# EAGLE design adapter1 (EAGLE 7.2.0)
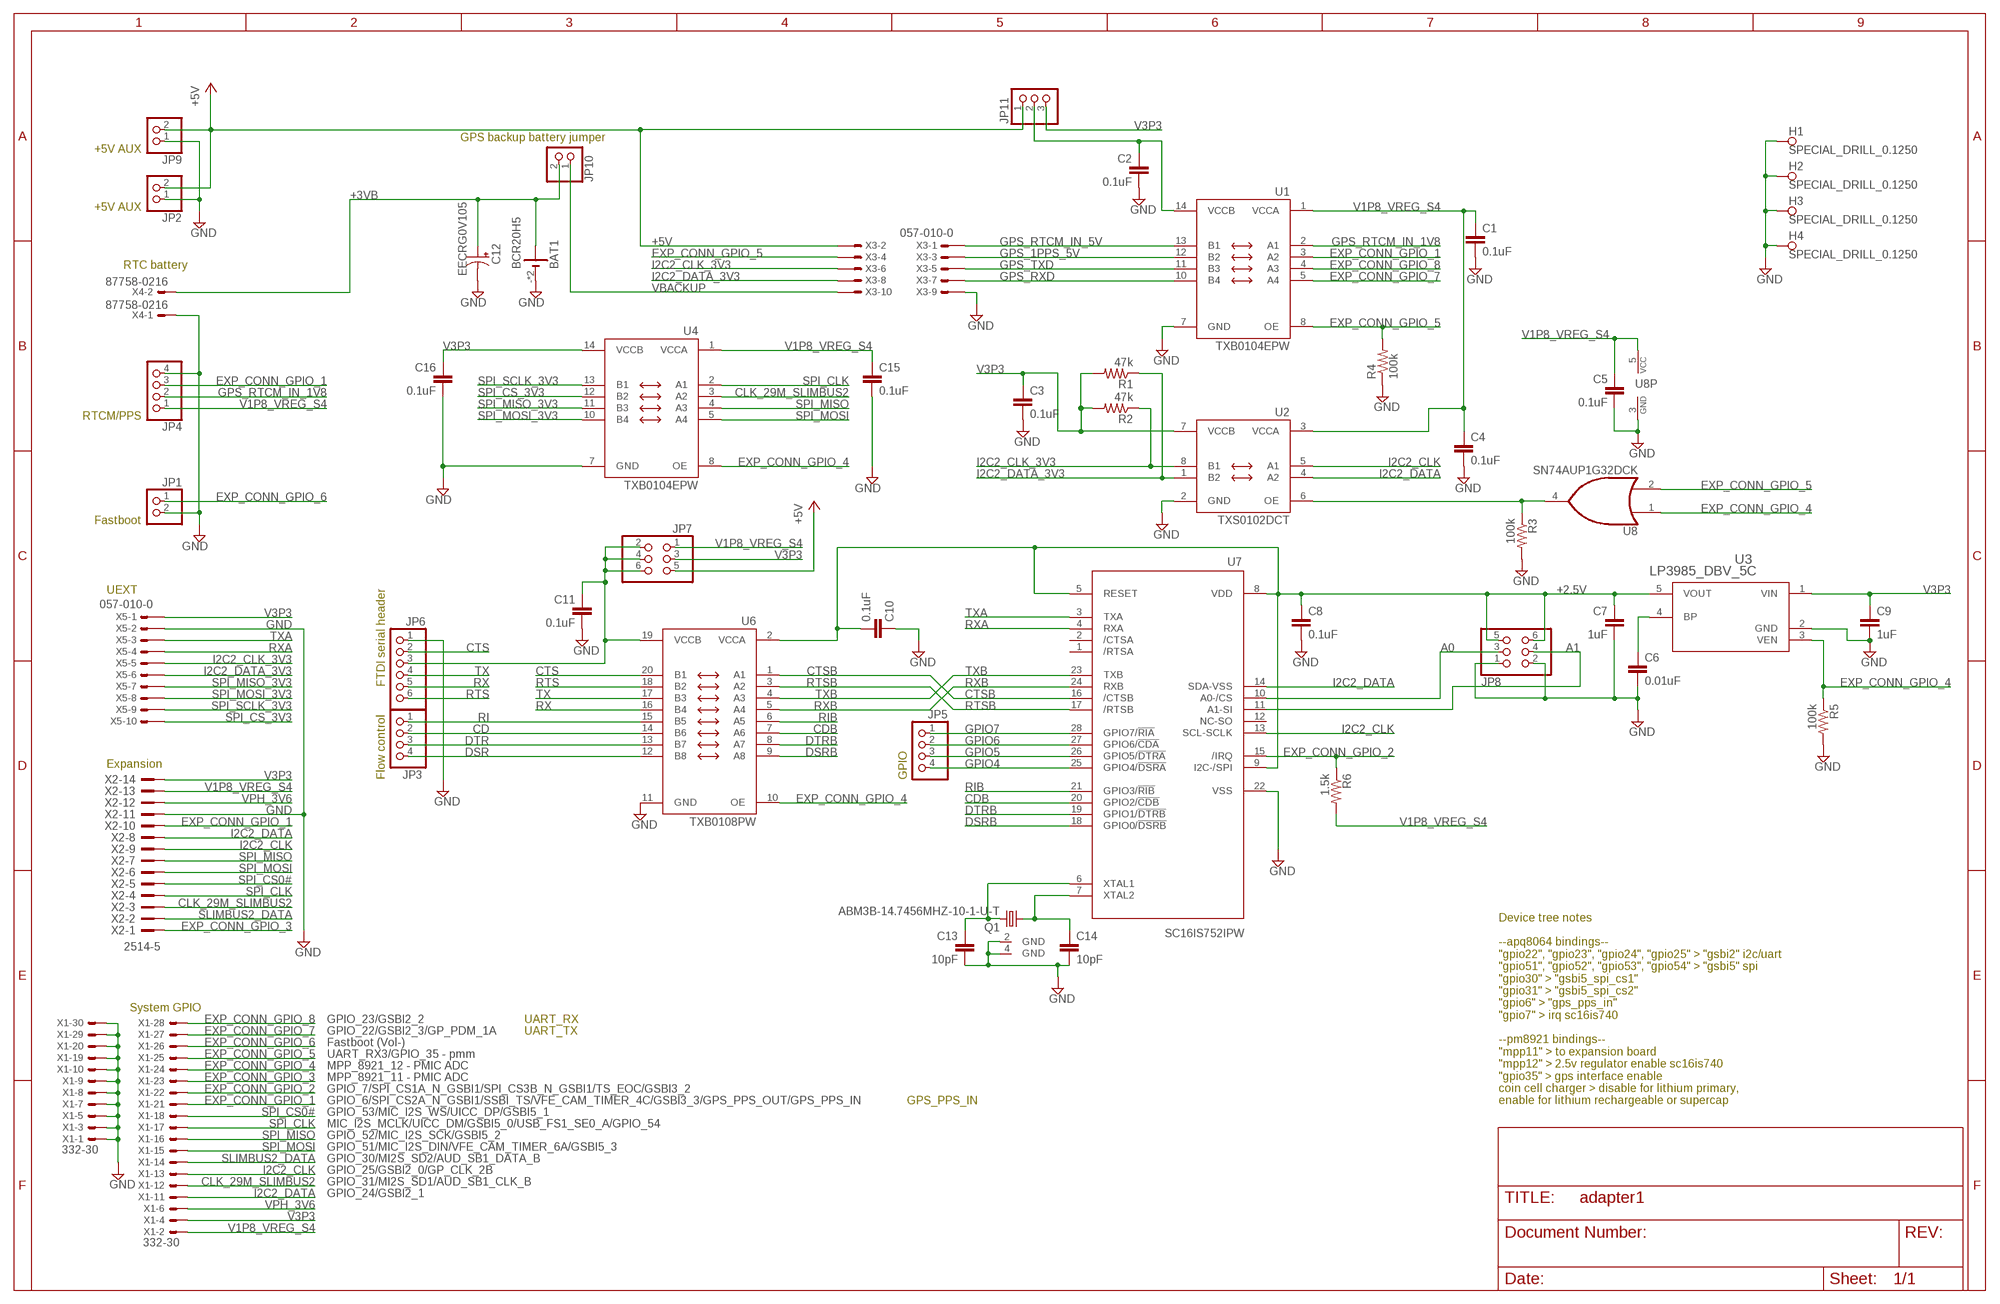
[diagram p0: schematic, sheet 1]

## Parts
BAT1  BCR20H5  BCR20H5_1066  [BCR20H5_1066]
C1  0.1uF  C-EUC0603  [C0603]
C2  0.1uF  C-EUC0603  [C0603]
C3  0.1uF  C-EUC0603  [C0603]
C4  0.1uF  C-EUC0603  [C0603]
C5  0.1uF  C-EUC0603  [C0603]
C6  0.01uF  C-EUC0603  [C0603]
C7  1uF  C-EUC0603  [C0603]
C8  0.1uF  C-EUC0603  [C0603]
C9  1uF  C-EUC0603  [C0603]
C10  0.1uF  C-EUC0603  [C0603]
C11  0.1uF  C-EUC0603  [C0603]
C12  EECRG0V105  CPOL-USE10-20  [EB20D]
C13  10pF  C-EUC0603  [C0603]
C14  10pF  C-EUC0603  [C0603]
C15  0.1uF  C-EUC0603  [C0603]
C16  0.1uF  C-EUC0603  [C0603]
H1  SPECIAL_DRILL_0.1250  [PAD_0.1250]
H2  SPECIAL_DRILL_0.1250  [PAD_0.1250]
H3  SPECIAL_DRILL_0.1250  [PAD_0.1250]
H4  SPECIAL_DRILL_0.1250  [PAD_0.1250]
JP1  PINHD-1X2/90  [1X02/90]
JP2  PINHD-1X2/90  [1X02/90]
JP3  PINHD-1X4/90  [1X04/90]
JP4  PINHD-1X4/90  [1X04/90]
JP5  PINHD-1X4/90  [1X04/90]
JP6  PINHD-1X6/90  [1X06/90]
JP7  PINHD-2X3/90  [2X03/90]
JP8  PINHD-2X3  [2X03]
JP9  PINHD-1X2/90  [1X02/90]
JP10  PINHD-1X2  [1X02]
JP11  PINHD-1X3  [1X03]
Q1  ABM3B-14.7456MHZ-10-1-U-T  C-SHIELDABM3B  [ABM3B]
R1  47k  R-US_R0603  [R0603]
R2  47k  R-US_R0603  [R0603]
R3  100k  R-US_R0603  [R0603]
R4  100k  R-US_R0603  [R0603]
R5  100k  R-US_R0603  [R0603]
R6  1.5k  R-US_R0603  [R0603]
U1  TXB0104EPW  TXS0104EPW  [PW_R-PDSO-G14]
U2  TXS0102DCT  [DCT_R-PDSO-G8]
U3  LP3985_DBV_5C  [MF05A-M]
U4  TXB0104EPW  TXS0104EPW  [PW_R-PDSO-G14]
U6  TXB0108PW  TXS0108PW  [PW_R-PDSO-G20]
U7  SC16IS752IPW  [SSOP28]
U8  SN74AUP1G32DCK  74AHC1G32DCK  [SC70-5]
X1  332-30  [332-30]
X2  2514-5  [PAK100/2500-5-14]
X3  057-010-0  [057-010-0]
X4  87758-0216  [87758-0216]
X5  057-010-0  [057-010-0]

## Nets
+2.5V: C7.1 C8.1 C10.2 JP8.5 JP8.6 U3.5(VOUT) U6.2(VCCA) U7.5(RESET) U7.8(VDD) U7.9(I2C-/SPI)
+3VB: BAT1.+ BAT1.+1(+) C12.+ JP10.2 X4.2
+5V: JP2.2 JP7.5 JP9.2 JP11.1 X3.2
A0: JP8.3 U7.10(A0-/CS)
A1: JP8.4 U7.11(A1-SI)
CD: JP3.2 U6.14(B6)
CDB: U6.7(A6) U7.20(GPIO2/!CDB)
CLK_29M_SLIMBUS2: U4.3(A2) X1.12 X2.3
CTS: JP6.2 U6.20(B1)
CTSB: U6.1(A1) U7.16(/CTSB)
DSR: JP3.4 U6.12(B8)
DSRB: U6.9(A8) U7.18(GPIO0/!DSRB)
DTR: JP3.3 U6.13(B7)
DTRB: U6.8(A7) U7.19(GPIO1/!DTRB)
EXP_CONN_GPIO_1: JP4.3 U1.3(A2) X1.21 X2.10
EXP_CONN_GPIO_2: R6.1 U7.15(/IRQ) X1.22
EXP_CONN_GPIO_3: X1.23 X2.1
EXP_CONN_GPIO_4: R5.1 U3.3(VEN) U4.8(OE) U6.10(OE) U8.1(I0) X1.24
EXP_CONN_GPIO_5: R4.2 U1.8(OE) U8.2(I1) X1.25 X3.4
EXP_CONN_GPIO_6: JP1.1 X1.26
EXP_CONN_GPIO_7: U1.5(A4) X1.27
EXP_CONN_GPIO_8: U1.4(A3) X1.28
GND: BAT1.- BAT1.-1(-) C1.2 C2.2 C3.2 C4.2 C5.2 C6.2 C7.2 C8.2 C9.2 C10.1 C11.2 C12.- C13.2 C14.2 C15.2 C16.2 H1.1 H2.1 H3.1 H4.1 JP1.2 JP2.1 JP4.4 JP6.1 JP8.1 JP8.2 JP9.1 Q1.2(GND) Q1.4(GND) R3.2 R4.1 R5.2 U1.7(GND) U2.2(GND) U3.2(GND) U4.7(GND) U6.11(GND) U7.22(VSS) U8.3(GND) X1.1 X1.3 X1.5 X1.7 X1.8 X1.9 X1.10 X1.19 X1.20 X1.29 X1.30 X2.11 X3.9 X4.1 X5.2
GPIO4: JP5.4 U7.25(GPIO4/!DSRA)
GPIO5: JP5.3 U7.26(GPIO5/!DTRA)
GPIO6: JP5.2 U7.27(GPIO6/!CDA)
GPIO7: JP5.1 U7.28(GPIO7/!RIA)
GPS_1PPS_5V: U1.12(B2) X3.3
GPS_RTCM_IN_1V8: JP4.2 U1.2(A1)
GPS_RTCM_IN_5V: U1.13(B1) X3.1
GPS_RXD: U1.10(B4) X3.7
GPS_TXD: U1.11(B3) X3.5
I2C2_CLK: U2.5(A1) U7.13(SCL-SCLK) X1.13 X2.9
I2C2_CLK_3V3: R2.1 U2.8(B1) X3.6 X5.5
I2C2_DATA: U2.4(A2) U7.14(SDA-VSS) X1.11 X2.8
I2C2_DATA_3V3: R1.1 U2.1(B2) X3.8 X5.6
N$2: C2.1 JP11.2 U1.14(VCCB)
N$3: C14.1 Q1.3 U7.7(XTAL2)
N$4: C13.1 Q1.1 U7.6(XTAL1)
N$5: C11.1 JP6.3 JP7.2 JP7.4 JP7.6 U6.19(VCCB)
N$6: C6.1 U3.4(BP)
N$13: R3.1 U2.6(OE) U8.4(O)
RI: JP3.1 U6.15(B5)
RIB: U6.6(A5) U7.21(GPIO3/!RIB)
RTS: JP6.6 U6.18(B2)
RTSB: U6.3(A2) U7.17(/RTSB)
RX: JP6.5 U6.16(B4)
RXA: U7.4(RXA) X5.4
RXB: U6.5(A4) U7.24(RXB)
SLIMBUS2_DATA: X1.14 X2.2
SPI_CLK: U4.2(A1) X1.17 X2.4
SPI_CS0#: X1.18 X2.5
SPI_CS_3V3: U4.12(B2) X5.10
SPI_MISO: U4.4(A3) X1.16 X2.7
SPI_MISO_3V3: U4.11(B3) X5.7
SPI_MOSI: U4.5(A4) X1.15 X2.6
SPI_MOSI_3V3: U4.10(B4) X5.8
SPI_SCLK_3V3: U4.13(B1) X5.9
TX: JP6.4 U6.17(B3)
TXA: U7.3(TXA) X5.3
TXB: U6.4(A3) U7.23(TXB)
V1P8_VREG_S4: C1.1 C4.1 C5.1 C15.1 JP4.1 JP7.1 R6.2 U1.1(VCCA) U2.3(VCCA) U4.1(VCCA) U8.5(VCC) X1.2 X2.13
V3P3: C3.1 C9.1 C16.1 JP7.3 JP11.3 R1.2 R2.2 U2.7(VCCB) U3.1(VIN) U4.14(VCCB) X1.4 X2.14 X5.1
VBACKUP: JP10.1 X3.10
VPH_3V6: X1.6 X2.12
Unconnected: U7.1(/RTSA) U7.2(/CTSA) U7.12(NC-SO)

## Notes on the sheet
- GPS backup battery jumper
- +5V AUX
- +5V AUX
- RTC battery
- RTCM/PPS
- Fastboot
- UEXT
- FTDI serial header
- Expansion
- Flow control | GPIO
- System GPIO
- GPIO_23/GSBI2_2 | UART_RX
- GPIO_22/GSBI2_3/GP_PDM_1A | UART_TX
- Fastboot (Vol-)
- UART_RX3/GPIO_35 - pmm
- MPP_8921_12 - PMIC ADC
- MPP_8921_11 - PMIC ADC
- GPIO_7/SPI_CS1A_N_GSBI1/SPI_CS3B_N_GSBI1/TS_EOC/GSBI3_2
- GPIO_6/SPI_CS2A_N_GSBI1/SSBI_TS/VFE_CAM_TIMER_4C/GSBI3_3/GPS_PPS_OUT/GPS_PPS_IN | GPS_PPS_IN
- Device tree notes
  
  --apq8064 bindings--
  "gpio22", "gpio23", "gpio24", "gpio25" > "gsbi2" i2c/uart
  "gpio51", "gpio52", "gpio53", "gpio54" > "gsbi5" spi
  "gpio30" > "gsbi5_spi_cs1"
  "gpio31" > "gsbi5_spi_cs2"
  "gpio6" > "gps_pps_in"
  "gpio7" > irq sc16is740
  
  --pm8921 bindings--
  "mpp11" > to expansion board
  "mpp12" > 2.5v regulator enable sc16is740
  "gpio35" > gps interface enable
  coin cell charger > disable for lithium primary,
  enable for lithium rechargeable or supercap
- GPIO_53/MIC_I2S_WS/UICC_DP/GSBI5_1
- MIC_I2S_MCLK/UICC_DM/GSBI5_0/USB_FS1_SE0_A/GPIO_54
- GPIO_52/MIC_I2S_SCK/GSBI5_2
- GPIO_51/MIC_I2S_DIN/VFE_CAM_TIMER_6A/GSBI5_3
- GPIO_30/MI2S_SD2/AUD_SB1_DATA_B
- GPIO_25/GSBI2_0/GP_CLK_2B
- GPIO_31/MI2S_SD1/AUD_SB1_CLK_B
- GPIO_24/GSBI2_1

## Library data of the parts
BAT1 = battery holders:BCR20H5_1066
C1-C11 C13-C16 = rcl:C-EU: CAPACITOR, European symbol
C12 = rcl:CPOL-US: POLARIZED CAPACITOR, American symbol
H1-H4 = special-drill:SPECIAL_DRILL_: Special drills
JP1 JP2 JP9 JP10 = pinhead:PINHD-1X2: PIN HEADER
JP3-JP5 = pinhead:PINHD-1X4: PIN HEADER
JP6 = pinhead:PINHD-1X6: PIN HEADER
JP7 JP8 = pinhead:PINHD-2X3: PIN HEADER
JP11 = pinhead:PINHD-1X3: PIN HEADER
Q1 = crystal:C-SHIELD
R1-R6 = rcl:R-US_: RESISTOR, American symbol
U1 U4 = texas-1:TXS0104
U2 = texas-1:TXS0102
U3 = LP3985:LP3985_DBV_5
U6 = texas-1:TXS0108
U7 = sc16is740:SC16IS752
U8 = 74xx-little-us:74*1G32: 2-input OR gate
X1 = con-garry:332-30: 30 Pin - 2mm Dual Row Source: www.mpe-connector.de / garry_shortform_2012.pdf
X2 = con-3m:2514-: 3M (TM) Pak 100 4-Wall Header Source: 3M; MPN: N2514-5002RB; OC_FARNELL: 1788673; OC_NEWARK: 97K6709
X3 X5 = con-panduit:057-010-: CONNECTOR 10-pin series 057 contact pc board low profile headers; OC_FARNELL: unknown; OC_NEWARK: unknown
X4 = con-molex:87758-0216: 2 Pin - 2mm Dual Row Single Wafer, Vertical T/H HDR Source: http://www.molex.com/pdm_docs/sd/877580616_sd.pdf; MPN: 87758-0216; OC_FARNELL: unknown; OC_NEWARK: 94M1513

## Board
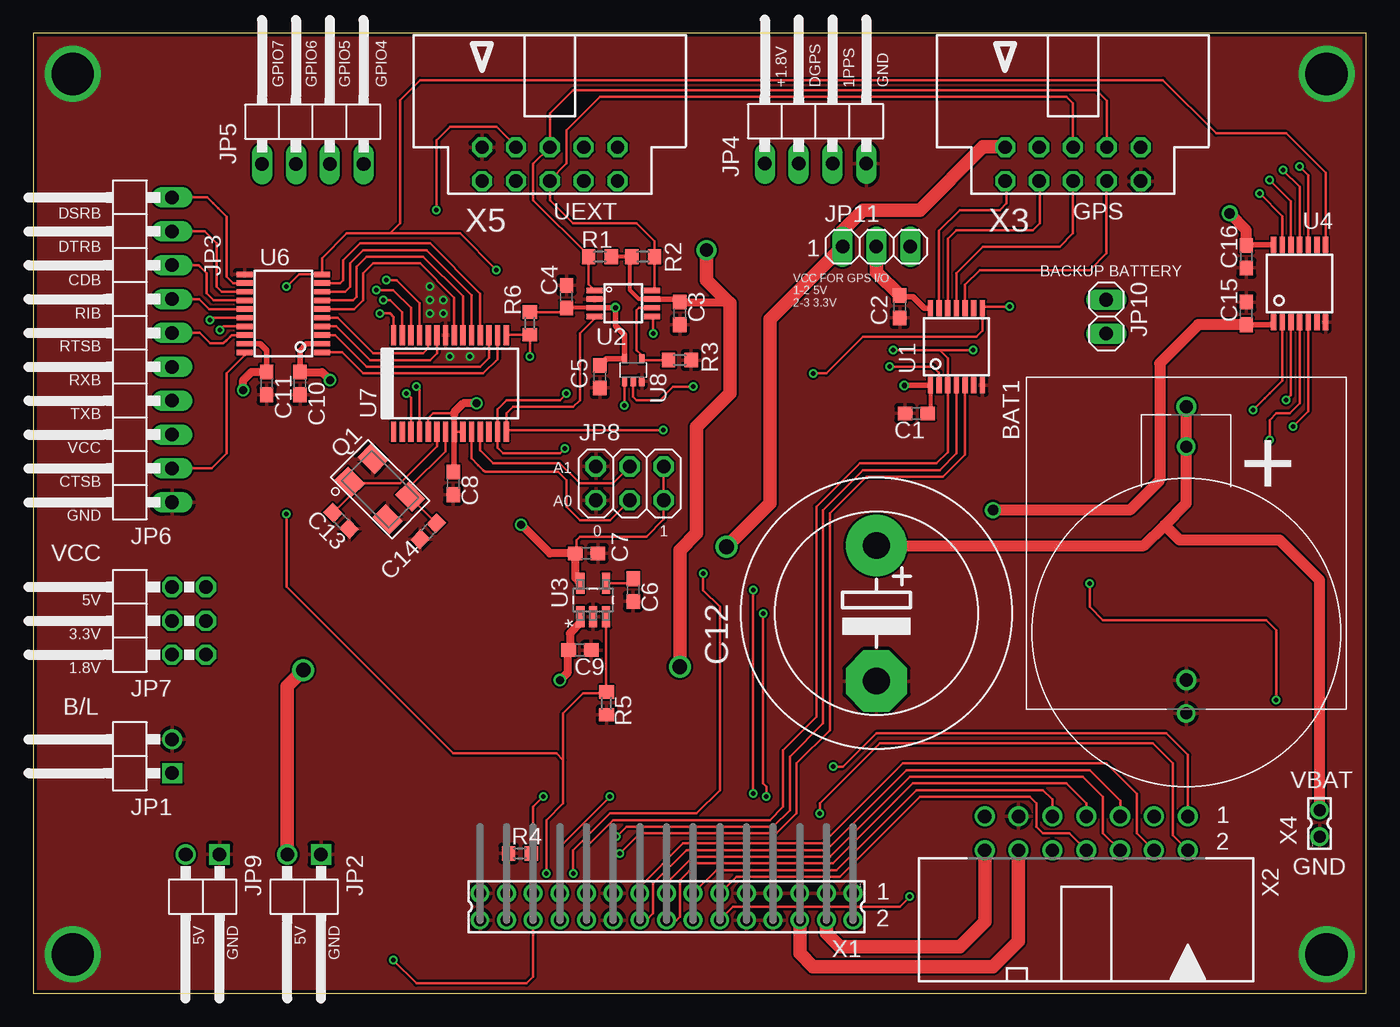
[diagram p1: board, top side]
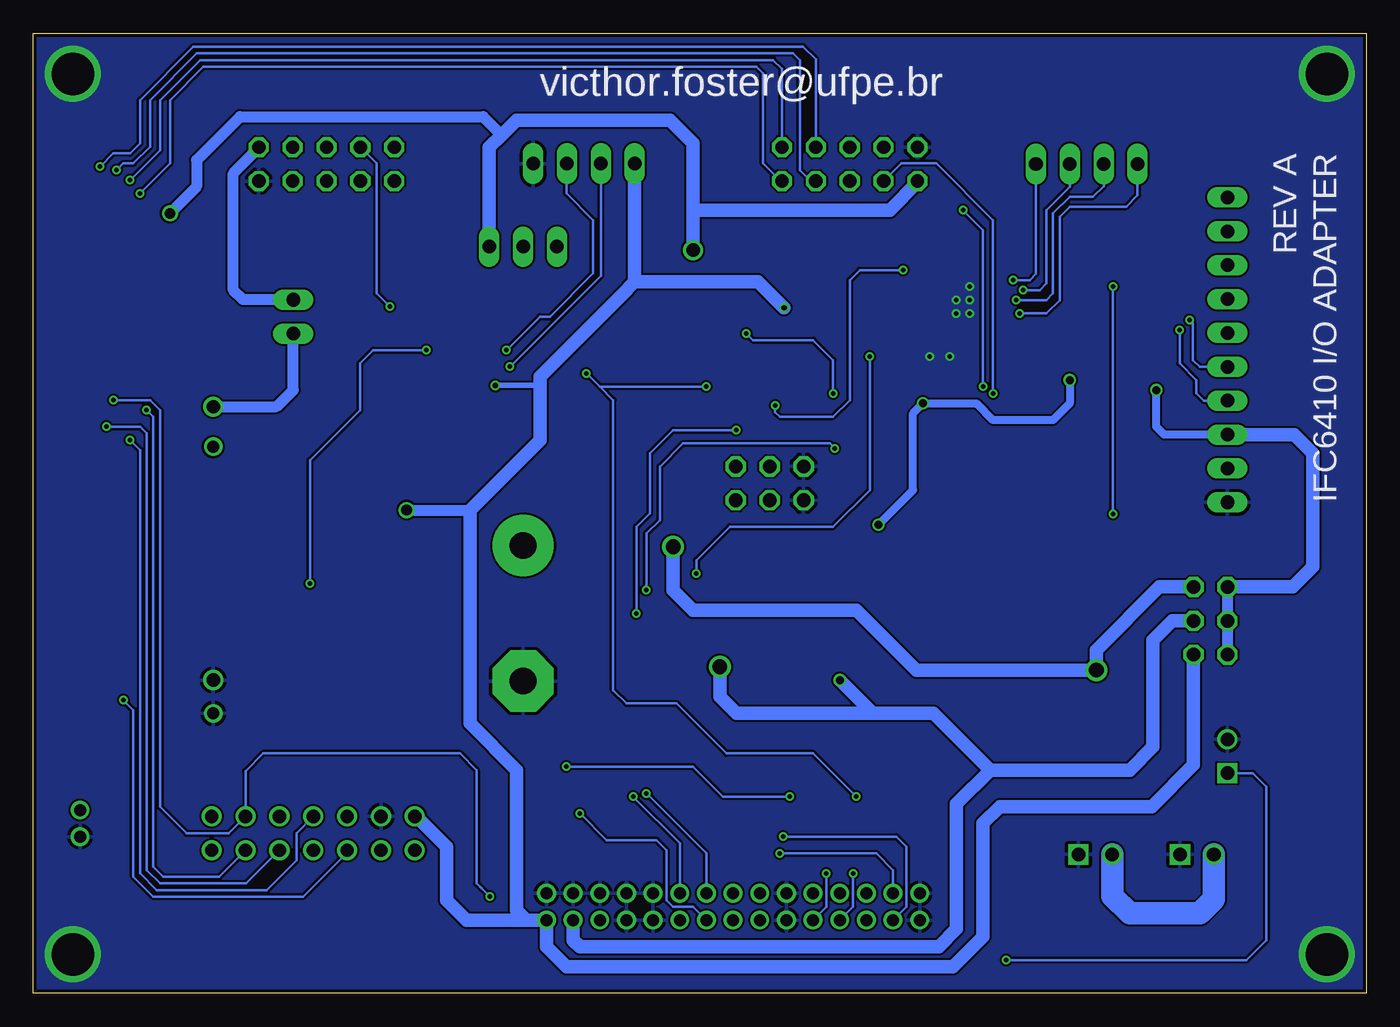
[diagram p2: board, bottom side, seen from below]

Size 100 x 72 mm. Coordinates in mm from the lower left corner, seen from the top.
Outline: 0,0 100,0 100,72 0,72 0,0
Copper layers (1*16): Top 0.035mm / dielectric 1.5mm / Bottom 0.035mm
Design rules "ITEADstudio_DRC": minimum track width 6mil, minimum drill 12mil, track to track 6mil, track to pad 6mil, pad to pad 6mil, via to via 6mil, smd to smd 0mil, copper to edge 10mil, drill to drill 10mil, minimum pad ring 10mil, minimum via ring 6mil, stop-mask expansion 2mil, vias tented up to drill 100mil, thermal gap 10mil

### Footprints (pad centres in the part's own frame; a part is rotated, then mirrored left to right if it is on the bottom)
BCR20H5_1066 = drill 1: + -10.25,0; - 10.25,0 | drill 0.89: +1 -7.25,0; -1 12.75,0
C0603 = smd 1.1 x 1: 1 -0.85,0; 2 0.85,0
EB20D = drill 2.007 pad 4.597: + -5.08,0 | drill 2.007 pad 4.597 octagon: - 5.08,0
PAD_0.1250 = drill 3.175 pad 3.175: 1 0,0
1X02/90 = drill 1.016 square: 1 -1.27,-3.81 | drill 1.016: 2 1.27,-3.81
1X04/90 = drill 1.016 long: 1 -3.81,-3.81; 2 -1.27,-3.81; 3 1.27,-3.81; 4 3.81,-3.81
1X06/90 = drill 1.016 long: 1 -6.35,-3.81; 2 -3.81,-3.81; 3 -1.27,-3.81; 4 1.27,-3.81; 5 3.81,-3.81; 6 6.35,-3.81
2X03/90 = drill 1.016 octagon: 1 -2.54,-6.35; 2 -2.54,-3.81; 3 0,-6.35; 4 0,-3.81; 5 2.54,-6.35; 6 2.54,-3.81
2X03 = drill 1.016 octagon: 1 -2.54,-1.27; 2 -2.54,1.27; 3 0,-1.27; 4 0,1.27; 5 2.54,-1.27; 6 2.54,1.27
1X02 = drill 1.016 long: 1 -1.27,0; 2 1.27,0
1X03 = drill 1.016 long: 1 -2.54,0; 2 0,0; 3 2.54,0
ABM3B = smd 1.8 x 1.4: 1 -2,-1.2; 2 2,-1.2; 3 2,1.2; 4 -2,1.2
R0603 = smd 1 x 1.1: 1 -0.85,0; 2 0.85,0
PW_R-PDSO-G14 = smd 0.4 x 1.2: 1 -1.95,-2.9; 2 -1.3,-2.9; 3 -0.65,-2.9; 4 0,-2.9; 5 0.65,-2.9; 6 1.3,-2.9; 7 1.95,-2.9; 8 1.95,2.9; 9 1.3,2.9; 10 0.65,2.9; 11 0,2.9; 12 -0.65,2.9; 13 -1.3,2.9; 14 -1.95,2.9
DCT_R-PDSO-G8 = smd 0.4 x 1.2: 1 -0.975,-2.157; 2 -0.325,-2.157; 3 0.325,-2.157; 4 0.975,-2.157; 5 0.975,2.157; 6 0.325,2.157; 7 -0.325,2.157; 8 -0.975,2.157
MF05A-M = smd 1.575 x 0.61: 1 -1.27,0.965; 2 -1.27,0; 3 -1.27,-0.965; 4 1.27,-0.965; 5 1.27,0.965
PW_R-PDSO-G20 = smd 0.4 x 1.2: 1 -2.925,-2.9; 2 -2.275,-2.9; 3 -1.625,-2.9; 4 -0.975,-2.9; 5 -0.325,-2.9; 6 0.325,-2.9; 7 0.975,-2.9; 8 1.625,-2.9; 9 2.275,-2.9; 10 2.925,-2.9; 11 2.925,2.9; 12 2.275,2.9; 13 1.625,2.9; 14 0.975,2.9; 15 0.325,2.9; 16 -0.325,2.9; 17 -0.975,2.9; 18 -1.625,2.9; 19 -2.275,2.9; 20 -2.925,2.9
SSOP28 = smd 0.4 x 1.5: 1 -4.225,-3.625; 2 -3.575,-3.625; 3 -2.925,-3.625; 4 -2.275,-3.625; 5 -1.625,-3.625; 6 -0.975,-3.625; 7 -0.325,-3.625; 8 0.325,-3.625; 9 0.975,-3.625; 10 1.625,-3.625; 11 2.275,-3.625; 12 2.925,-3.625; 13 3.575,-3.625; 14 4.225,-3.625; 15 4.225,3.625; 16 3.575,3.625; 17 2.925,3.625; 18 2.275,3.625; 19 1.625,3.625; 20 0.975,3.625; 21 0.325,3.625; 22 -0.325,3.625; 23 -0.975,3.625; 24 -1.625,3.625; 25 -2.275,3.625; 26 -2.925,3.625; 27 -3.575,3.625; 28 -4.225,3.625
SC70-5 = smd 0.4 x 0.7: 1 -0.65,-0.85; 2 0,-0.85; 3 0.65,-0.85; 4 0.65,0.85; 5 -0.65,0.85
332-30 = drill 0.9 pad 1.27: 1 -14,-1; 2 -14,1; 3 -12,-1; 4 -12,1; 5 -10,-1; 6 -10,1; 7 -8,-1; 8 -8,1; 9 -6,-1; 10 -6,1; 11 -4,-1; 12 -4,1; 13 -2,-1; 14 -2,1; 15 0,-1; 16 0,1; 17 2,-1; 18 2,1; 19 4,-1; 20 4,1; 21 6,-1; 22 6,1; 23 8,-1; 24 8,1; 25 10,-1; 26 10,1; 27 12,-1; 28 12,1; 29 14,-1; 30 14,1
PAK100/2500-5-14 = drill 1 pad 1.422: 1 -7.62,-1.27; 2 -7.62,1.27; 3 -5.08,-1.27; 4 -5.08,1.27; 5 -2.54,-1.27; 6 -2.54,1.27; 7 0,-1.27; 8 0,1.27; 9 2.54,-1.27; 10 2.54,1.27; 11 5.08,-1.27; 12 5.08,1.27; 13 7.62,-1.27; 14 7.62,1.27
057-010-0 = drill 1 octagon: 1 -5.08,-5.08; 2 -5.08,-2.54; 3 -2.54,-5.08; 4 -2.54,-2.54; 5 0,-5.08; 6 0,-2.54; 7 2.54,-5.08; 8 2.54,-2.54; 9 5.08,-5.08; 10 5.08,-2.54
87758-0216 = drill 0.9 pad 1.27: 1 0,-1; 2 0,1

### Placement (x,y rotation side)
BAT1  86.5,33.75 270 top
C1  66.25,43.5 180 top
C2  65,51.5 270 top
C3  48.5,51 270 top
C4  40,52.25 90 top
C5  42.5,46.25 270 top
C6  45,30.25 270 top
C7  41.5,33 0 top
C8  31.5,38.25 270 top
C9  41,25.75 0 top
C10  20,45.75 90 top
C11  17.5,45.75 270 top
C12  63.25,28.5 270 top
C13  23.08,35.43 315 top
C14  29.63,34.66 225 top
C15  91,51 90 top
C16  91,55.25 270 top
H1  2.95,2.92 0 top
H2  97.03,2.92 0 top
H3  97.03,68.96 0 top
H4  2.95,68.96 0 top
JP1  6.6,17.78 90 top
JP2  20.32,6.6 180 top
JP3  6.6,55.88 90 top
JP4  58.69,66.04 0 top
JP5  20.97,66 0 top
JP6  6.6,43.18 90 top
JP7  6.6,27.94 90 top
JP8  44.75,38.25 0 top
JP9  12.7,6.6 180 top
JP10  80.5,50.75 270 top
JP11  63.25,56 0 top
Q1  26.02,37.81 315 top
R1  42.5,55.25 0 top
R2  45.75,55.25 180 top
R3  48.5,47.5 0 top
R4  36.5,10.5 0 top
R5  43,21.75 270 top
R6  37.25,50.25 90 top
U1  69.25,48.5 0 top
U2  44.25,51.75 270 top
U3  42,29.5 90 top
U4  95,53.25 0 top
U6  18.75,51 90 top
U7  31.25,45.75 0 top
U8  45,46.75 0 top
X1  47.5,6.5 180 top
X2  79,12 180 top
X3  78,66 0 top
X4  96.5,12.75 0 top
X5  38.75,66 0 top

### Tracks (layer width: path | path; a pad name or v marks a point on that pad's centre or on a via)
+2.5V  (via drill 0.6)
  Top 0.203: JP8.6 JP8.5 47.29,35.54 46,34.25 41,34.25 40.75,34 40.75,33.1 C7.1 | U7.8 U7.9 | U7.5 29.62,43.12 30,43.5 31.5,43.5 31.57,43.58
  Top 0.406: C8.1 31.57,38.92 U7.8 31.57,43.42 | C10.2 20,48.25 20.48,48.73 U6.2
  Top 0.508: v36.6,35.15 36.65,35.1
  Top 0.61: 36.65,35.1 38.75,33 C7.1 40.65,31.16 U3.5 | v33.25,44.25 32.25,44.25 31.57,43.58 31.57,43.42 | C10.2 21.65,46.6 v22.25,46
  Bottom 0.61: v36.6,35.15 34,37.75 34,43.5 v33.25,44.25 29.25,44.25 28,43 23.5,43 22.25,44.25 v22.25,46
+3VB
  Top 0.813: C12.+ 83.33,33.58 84.88,35.12 | 84.88,35.12 86.5,36.75 BAT1.+1 BAT1.+ | X4.2 96.5,31 93.5,34 86,34 84.88,35.12
  Bottom 0.813: BAT1.+ 81.75,44 80.5,45.25 JP10.2
+5V  (via drill 1.1)
  Top 1.016: JP2.2 19.05,23.05 v20.25,24.25 | v52,33.5 55.25,36.75 55.25,50.54 JP11.1 60.71,57.21 62.25,58.75 66.5,58.75 71.25,63.5 72.88,63.5 X3.2 72.71,63.46
  Bottom 1.016: JP7.5 15.52,30.48 20.25,25.75 v20.25,24.25 33.75,24.25 38.25,28.75 50.5,28.75 52,30.25 v52,33.5
  Bottom 1.676: JP9.2 11.43,7.07 12.5,6 17.75,6 19.05,7.3 JP2.2
A0
  Top 0.203: JP8.3 43.27,35.5 41,35.5 40,36.5 40,38.5 39.38,39.12 33.88,39.12 33.75,39.25 33.38,39.62 32.88,40.12 U7.10
A1
  Top 0.203: JP8.4 43.48,38.25 41,38.25 39.48,39.77 34.48,39.77 33.52,40.73 U7.11
CD
  Top 0.203: U6.14 13.53,51.98 13,52.5 13,54 12.5,54.5 12.39,54.61 JP3.2
CDB
  Top 0.203: U7.20 32.23,52.27 29.25,55.25 25,55.25 24.25,54.5 24.25,52.25 23.98,51.98 U6.7
CLK_29M_SLIMBUS2  (via drill 0.33)
  Top 0.203: X1.12 52.5,6.5 65,6.5 v65.75,7.25 | U4.3 94.35,44.85 v94,44.5
  Bottom 0.203: v65.75,7.25 66.38,7.88 66.5,8 66.75,8.25 66.75,16.75 68,18 82.75,18 84.08,16.67 X2.3 85.35,12 88.5,12 90.5,14 90.5,43.75 91.25,44.5 v94,44.5
CTS
  Top 0.203: JP6.2 13.37,39.37 14.5,40.5 14.5,46.5 15.85,47.85 U6.20
CTSB
  Top 0.203: U7.16 34.83,47.58 33.75,46.5 24.75,46.5 23.18,48.08 U6.1
DSR
  Top 0.203: U6.12 14.97,53.27 14.5,53.75 14.5,58.25 13.88,58.88 13.5,59.25 13.06,59.69 JP3.4
DSRB
  Top 0.203: U7.18 33.52,52.48 29.75,56.25 24.5,56.25 23.25,55 23.25,53.5 23.02,53.27 U6.9
DTR
  Top 0.203: U6.13 14.12,52.62 13.75,53 13.75,56.25 12.85,57.15 JP3.3
DTRB
  Top 0.203: U7.19 32.88,52.38 29.5,55.75 24.75,55.75 23.75,54.75 23.75,53 23.38,52.62 U6.8
EXP_CONN_GPIO_1  (via drill 0.33)
  Top 0.203: X1.21 41.5,11 43.5,13 55.25,13 56.25,14 56.25,18.25 58.75,20.75 58.75,36.5 62,39.75 67.75,39.75 68.6,40.6 U1.3 68.6,47.65 68,48.25 | 68,48.25 v64.5,48.25 | v93.25,22 93.25,27.25 92.5,28 80.25,28 79.25,29 v79.25,30.75 | v70.5,48.25 68,48.25
  Bottom 0.203: v64.5,48.25 62,50.75 61.25,50.75 58,54 58,58 60,60 60,62.19 JP4.3 | X2.10 76.46,10.54 79.75,7.25 91,7.25 92.5,8.75 92.5,21.25 v93.25,22 | v79.25,30.75 79.25,40 75.5,43.75 75.5,47.25 74.5,48.25 v70.5,48.25
EXP_CONN_GPIO_2  (via drill 0.33)
  Top 0.203: v40.5,9 40.5,10.75 43.25,13.5 49.75,13.5 51.5,15.25 51.5,29 50.25,30.25 v50.25,31.5 | U7.15 35.5,49.4 R6.1 v37.25,47.75
  Bottom 0.203: X1.22 40.5,6.5 v40.5,9 | v37.25,47.75 37.25,37.75 40,35 47.75,35 50.25,32.5 v50.25,31.5
EXP_CONN_GPIO_3  (via drill 0.33)
  Top 0.203: X1.23 39.5,11 v43.25,14.75 | X2.1 86.62,17.88 85,19.5 63.25,19.5 60.75,17 v60,17
  Bottom 0.203: v60,17 50.5,17 48.25,14.75 v43.25,14.75
EXP_CONN_GPIO_4  (via drill 0.33)
  Top 0.203: v38.5,9 38.5,13 39.75,14.25 39.75,17.5 | 39.75,17.5 39.75,21 41.25,22.5 42.9,22.5 R5.1 42.97,22.64 U3.3 | v19,35.95 19,30.5 31.5,18 39.25,18 39.75,17.5 | U8.1 v44.35,44.1 | v34.75,54.25 32,57 26.75,57 | 26.75,57 23.5,57 21.65,55.15 U6.10 19.93,53.92 v19,53 | 26.75,57 27.5,57.75 27.5,67 29,68.5 84.75,68.5 88.75,64.5 94,64.5 96.95,61.55 U4.8
  Bottom 0.203: X1.24 38.5,6.5 v38.5,9 | v44.35,44.1 44.35,43.6 44,43.25 40,43.25 38.75,44.5 38.75,53.5 38,54.25 v34.75,54.25 | v19,35.95 v19,53
EXP_CONN_GPIO_5  (via drill 0.33)
  Top 0.203: v38.25,14.75 37.5,14 37.5,10 | X1.25 37.5,10 | R4.2 37.5,10 | v58.5,46.5 59.5,46.5 62.25,49.25 70.75,49.25 71.2,49.7 U1.8 71.3,51.5 v73.25,51.5 | U8.2 45,44.75 45.25,44.5 47,44.5 48,45.5 v49.5,45.5
  Bottom 0.203: v38.25,14.75 41.5,18 48,18 51.75,21.75 55.5,21.75 56.5,22.75 56.5,44.5 57.5,45.5 | X3.4 74.25,62.25 74.25,52.5 v73.25,51.5 | v49.5,45.5 57.5,45.5 | 57.5,45.5 v58.5,46.5
EXP_CONN_GPIO_6  (via drill 0.33)
  Top 0.203: v27,2.5 28.75,0.75 37,0.75 37.5,1.25 X1.26
  Bottom 0.203: JP1.1 8.51,16.51 7.5,15.5 7.5,4 9,2.5 v27,2.5
EXP_CONN_GPIO_7  (via drill 0.33)
  Top 0.203: U1.5 69.9,40.4 68.25,38.75 62.5,38.75 59.75,36 59.75,19.75 57.25,17.25 57.25,13.5 55.75,12 45.5,12 v44,10.5
  Bottom 0.203: v44,10.5 36.75,10.5 35.5,9.25 X1.27
EXP_CONN_GPIO_8  (via drill 0.33)
  Top 0.203: U1.4 69.25,40.5 68,39.25 62.25,39.25 59.25,36.25 59.25,20.25 56.75,17.75 56.75,13.75 55.5,12.5 44.5,12.5 v43.75,11.75
  Bottom 0.203: v43.75,11.75 35.25,11.75 34.5,11 34.5,6.5 X1.28
GND  (via drill 0.33)
  other vias: 29.75,53 30.75,51 29.75,51 29.75,52 30.75,52 31.25,47.75 32.75,47.75
  pour Bottom: 0,0 100,0 100,72 0,72
  pour Top: 0,0 100,0 100,72 0,72
GPIO4  (via drill 0.33)
  Top 0.203: U7.25 28.98,51.77 27.25,53.5 v26.5,53.5
  Bottom 0.203: JP5.4 24.78,53.97 25.25,53.5 v26.5,53.5
GPIO5  (via drill 0.33)
  Top 0.203: U7.26 28.32,51.42 27,52.75 v25.75,52.75
  Bottom 0.203: JP5.3 22.24,60.51 24,58.75 24,53.25 24.5,52.75 v25.75,52.75
GPIO6  (via drill 0.33)
  Top 0.203: U7.27 27.68,51.08 26.75,52 v26.25,52
  Bottom 0.203: v26.25,52 24,52 23.5,52.5 23.5,58.5 22.25,59.75 20.5,59.75 19.7,60.55 JP5.2
GPIO7  (via drill 0.33)
  Top 0.203: U7.28 27.02,50.73 26.75,51 v26,51
  Bottom 0.203: v26,51 24,51 23,52 23,58.25 22.25,59 18,59 17.16,59.84 JP5.1
GPS_1PPS_5V
  Top 0.203: U1.12 68.6,56.6 69.25,57.25 75,57.25 75.5,57.75 75.5,60.88 X3.3 75.33,60.92
GPS_RTCM_IN_1V8  (via drill 0.33)
  Top 0.203: U1.2 67.95,46.55 67.5,47 v64.25,47
  Bottom 0.203: v64.25,47 57.42,53.83 JP4.2
GPS_RTCM_IN_5V
  Top 0.203: U1.13 67.95,57.2 69.5,58.75 72.5,58.75 73,59.25 73,60.84 X3.1
GPS_RXD
  Top 0.203: U1.10 69.9,53.15 71,54.25 79.25,54.25 80.5,55.5 80.5,60.88 X3.7
GPS_TXD
  Top 0.203: U1.11 69.25,54 71.25,56 77,56 78,57 X3.5
I2C2_CLK  (via drill 0.33)
  Top 0.203: v54,15 v54,30.25 | X1.13 51.25,9.25 60.25,9.25 66.25,15.25 75.75,15.25 76.46,14.54 X2.9 | v46.5,49.5 46.5,50.68 U2.5 | v39.88,40.88 39.5,40.5 35.25,40.5 34.83,40.92 U7.13 34.83,43.83 35.5,44.5 39.5,44.5 v40,45
  Bottom 0.203: X1.13 49.5,10.5 v54,15 | 40,41 v39.88,40.88 40.25,41.25 51.25,41.25 53,39.5 53,35.5 54,34.5 v54,30.25 | v46.5,49.5 46,49 41.5,49 40,47.5 v40,45
I2C2_CLK_3V3
  Top 0.203: U2.8 46.6,52.92 R2.1 46.6,56.4 45.25,57.75 40.5,57.75 38.75,59.5 X5.5 38.75,61 40,62.25 40,64.75 42.5,67.25 77.5,67.25 78,66.75 X3.6
I2C2_DATA  (via drill 0.33)
  Top 0.203: v55,14.75 55,15.5 54.75,15.75 v54.75,28.5 | X1.11 52.75,8.75 60.5,8.75 66.5,14.75 74.75,14.75 75.25,14.25 75.25,12.5 75.75,12 77.73,12 X2.8 | U2.4 42.09,50.59 41,49.5 41,44.5 40.5,44 36,44 35.5,43.5 35.5,42.15 U7.14 35.6,42.25 v47.25,42.25
  Bottom 0.203: X1.11 51.5,11.25 v55,14.75 | v47.25,42.25 52,42.25 53.75,40.5 53.75,36 54.75,35 v54.75,28.5
I2C2_DATA_3V3
  Top 0.203: U2.1 41.65,53.17 R1.1 41.65,55.35 37.5,59.5 37.5,62.21 X5.6 38.75,66 40.5,67.75 79.75,67.75 80.54,66.96 X3.8
N$2
  Top 0.406: U1.14 66.85,51.4 66,52.25 65.1,52.25 C2.1
  Top 1.016: JP11.2 63.25,54.1 C2.1
N$3
  Top 0.203: C14.1 28.28,37.21 Q1.3 28.28,38.03 30.93,40.67 U7.7
N$4
  Top 0.203: C13.1 23.75,37.31 Q1.1 24.13,38 24.25,38 24.5,38.25 27.5,38.25 30.27,41.02 U7.6
N$5  (via drill 0.6)
  Top 0.406: C11.1 17.5,48.25 17.02,48.73 U6.19
  Top 0.61: v15.75,45.25 15.75,46 16.35,46.6 C11.1
  Bottom 0.61: JP6.3 15.16,41.91 15.75,42.5 v15.75,45.25
  Bottom 0.813: JP7.6 JP7.4 JP7.2
  Bottom 1.016: JP6.3 5.41,41.91 4,40.5 4,32 5.52,30.48 JP7.6
N$6
  Top 0.203: U3.4 44.67,30.77 C6.1
N$13
  Top 0.203: U2.6 45.42,51.42 45.25,51.25 45.25,48.25 45.65,47.85 U8.4 45.75,47.5 R3.1
RI
  Top 0.203: U6.15 13.18,51.33 12.43,52.07 JP3.1
RIB
  Top 0.203: U7.21 31.57,52.17 29,54.75 25.5,54.75 24.75,54 24.75,52 24.07,51.33 U6.6
RTS
  Top 0.203: U6.18 14.88,49.38 14.75,49.25 14.5,49 14.25,48.75 13.25,48.75 12.47,49.53 JP6.6
RTSB
  Top 0.203: U7.17 34.17,47.67 33.5,47 25,47 22.62,49.38 U6.3
RX  (via drill 0.33)
  Top 0.203: U6.16 13.43,50.67 v13.25,50.5
  Bottom 0.203: v13.25,50.5 13,50.25 13,47.5 12.5,47 10.42,47 JP6.5
RXA  (via drill 0.33)
  Top 0.203: U7.4 28.98,45.27 v28.75,45.5 | X5.4 36.21,63.54 34.75,65 31.25,65 30.25,64 v30.25,58.75
  Bottom 0.203: v28.75,45.5 28.75,57.25 v30.25,58.75
RXB
  Top 0.203: U7.24 29.62,48.38 29.25,48 25.5,48 22.82,50.67 U6.5
SLIMBUS2_DATA  (via drill 0.33)
  Top 0.203: X2.2 85.5,11.85 85.5,17.25 84,18.75 63.5,18.75 59,14.25 v59,13.5
  Bottom 0.203: X1.14 50.5,6.5 52,6.5 52.5,7 52.5,10.75 53.25,11.5 57,11.5 v59,13.5
SPI_CLK  (via drill 0.33)
  Top 0.203: X1.17 45.5,8 48.75,11.25 59.25,11.25 65.25,17.25 80.5,17.25 82.79,14.96 82.79,12.02 X2.4 | v91.5,43.75 92.38,44.62 92.75,45 93.7,45.95 U4.2
  Bottom 0.203: v91.5,43.75 91,43.25 91,9.5 90.25,8.75 86.06,8.75 X2.4
SPI_CS0#
  Top 0.203: X1.18 46,5.5 46.5,6 46.5,8.25 49,10.75 59.5,10.75 65.5,16.75 79.25,16.75 81.54,14.46 X2.5
SPI_CS_3V3  (via drill 0.33)
  Top 0.203: U4.12 94.35,59.4 v92.75,61
  Bottom 0.203: X5.10 43.83,69.33 44.5,70 87.5,70 90.5,67 90.5,63.25 v92.75,61
SPI_MISO  (via drill 0.33)
  Top 0.203: X1.16 48.25,5.5 48.5,5.75 48.5,8.5 49.75,9.75 60,9.75 66,15.75 77.5,15.75 79,14.25 X2.7 | U4.4 95,44.25 94.25,43.5 93.25,43.5 92.75,43 v92.75,41.5
  Bottom 0.203: v92.75,41.5 92,40.75 92,9 90.75,7.75 82.5,7.75 80.25,10 80.25,12.02 X2.7
SPI_MISO_3V3  (via drill 0.33)
  Top 0.203: U4.11 95,60.5 v93.75,61.75
  Bottom 0.203: X5.7 41.67,60.92 42.5,61.75 42.5,70 43,70.5 87.75,70.5 91.25,67 91.25,63.5 92.5,62.25 93.25,62.25 v93.75,61.75
SPI_MOSI  (via drill 0.33)
  Top 0.203: X1.15 47.5,8.25 49.5,10.25 59.75,10.25 65.75,16.25 78.75,16.25 80.25,14.75 80.25,12.02 X2.6 | U4.5 95.65,43.65 v94.5,42.5
  Bottom 0.203: v94.5,42.5 92,42.5 91.5,42 91.5,9.25 90.5,8.25 84.02,8.25 X2.6
SPI_MOSI_3V3  (via drill 0.33)
  Top 0.203: U4.10 95.65,61.35 v95,62
  Bottom 0.203: X5.8 41.29,70.04 42.25,71 88,71 92,67 92,63.75 92.75,63 94,63 v95,62
SPI_SCLK_3V3  (via drill 0.33)
  Top 0.203: U4.13 93.7,58.3 v92,60
  Bottom 0.203: X5.9 43.92,60.92 45.25,62.25 45.25,69 45.75,69.5 87.25,69.5 89.75,67 89.75,62.25 v92,60
TX  (via drill 0.33)
  Top 0.203: U6.17 14.28,50.02 v14,49.75
  Bottom 0.203: v14,49.75 14,47.25 12.75,46 12.75,45 12.2,44.45 JP6.4
TXA  (via drill 0.33)
  Top 0.203: U7.3 28.32,44.67 v28,45
  Bottom 0.203: v28,45 28,58 32.25,62.25 34.88,62.25 X5.3
TXB
  Top 0.203: U7.23 30.27,48.02 29.75,47.5 25.25,47.5 22.73,50.02 U6.4
V1P8_VREG_S4  (via drill 0.4, 0.8)
  Top 0.203: R6.2 39.7,51.1 C4.1
  Top 0.305: U1.1 67.3,43.7 C1.1 | U2.3 40.33,51.42 C4.1
  Top 0.406: U1.1 v65.35,45.6 | U2.3 v43.67,51.42 43.67,50.08 44.35,49.4 U8.5 43,47.6 C5.1 | C15.1 92.85,50.15 U4.1
  Top 0.813: C15.1 87.4,50.15 84.5,47.25 84.5,38.5 82.25,36.25 v72,36.25
  Bottom 0.406: v65.35,45.6 62.1,45.6 62,45.5 | 55.75,52.5 55.88,52.38
  Bottom 0.813: v72,36.25 67.25,36.25
  Bottom 1.016: 13.1,25.4 JP7.1 12.95,17.13 16.09,14 27.5,14 28.75,12.75 28.75,4.25 31,2 60,2 61.5,3.5 X1.2 63,5.5 | 63,5.5 63.75,6.25 63.75,16.75 67.25,20.25 67.25,36.25 62,41.5 62,45.5 62,46.25 55.88,52.38 54.88,53.37 | X2.13 71.27,13.27 69,11 69,7 67.5,5.5 63,5.5 | JP4.1 54.88,53.37 | 54.88,53.37 45.62,53.37 v43.67,51.42
V3P3  (via drill 0.6, 0.8, 1, 1.1)
  Top 0.305: U2.7 45.42,52.08 44.75,52.75 44.75,55.1 R2.2 R1.2
  Top 0.406: U2.7 48.27,52.08 C3.1 | U4.14 91.05,56.15 C16.1
  Top 0.61: v39.5,23.5 40.1,24.1 40.1,25.45 C9.1 40.25,25.85 40.25,27 41.03,27.79 U3.1 | C3.1 51.85,51.85 52,52
  Top 0.813: C16.1 91,57.25 v89.75,58.5
  Top 1.016: X2.14 71.38,5.38 69.5,3.5 60.5,3.5 59.5,4.5 X1.4 | v50.5,55.75 50.5,53.5 52,52 52.25,51.75 52.25,45 49.75,42.5 49.75,34.5 48.5,33.25 v48.5,24.5
  Bottom 0.813: 64.88,64.38 66.25,65.75 84.5,65.75 87.75,62.5 87.75,60.5 v89.75,58.5
  Bottom 1.016: X1.4 59.5,4 59,3.5 32.06,3.5 30.73,4.83 30.73,14.22 28.21,16.75 | JP7.3 14.56,27.94 16,26.5 16,18.5 17.75,16.75 28.21,16.75 | v39.5,23.5 37,21 | JP11.3 65.79,63.46 64.88,64.38 63.75,65.5 52.25,65.5 50.5,63.75 50.5,58.75 | 37,21 47.25,21 48.5,22.25 v48.5,24.5 | X5.1 33.67,60.83 35.75,58.75 50.5,58.75 | 37,21 32.46,21 28.21,16.75 | v50.5,55.75 50.5,58.75
VBACKUP
  Bottom 0.813: X3.10 83.08,63.42 85,61.5 85,52.75 84.27,52.02 JP10.1
VPH_3V6
  Top 1.016: X2.12 73.92,3.92 72,2 58.5,2 57.5,3 X1.6

### Text on the board
tPlace: UEXT | GPS | 1 | BACKUP BATTERY | VCC FOR GPS I/O / 1-2 5V / 2-3 3.3V | A1 | A0 | 0 | 1 | B/L | VBAT | 1 | 2 | GND | 1 | 2
bPlace: victhor.foster@ufpe.br | IFC6410 I/O ADAPTER | REV A
tNames: GPIO7 | GPIO6 | GPIO5 | GPIO4 | +1.8V | DGPS | 1PPS | GND | DSRB | DTRB | CDB | RIB | RTSB | RXB | TXB | VCC | CTSB | GND | VCC | 5V | 3.3V | 1.8V | 5V | GND | 5V | GND